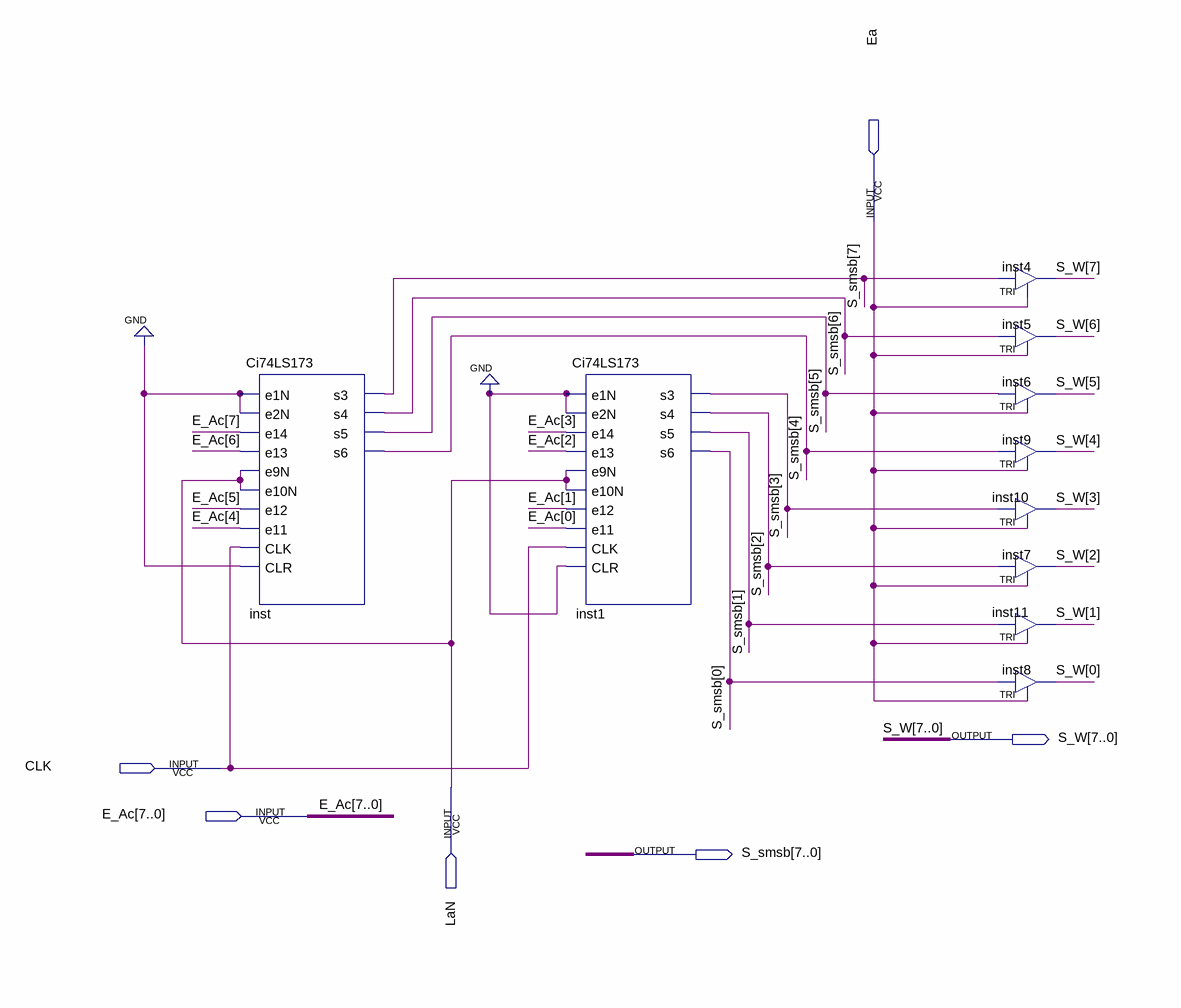
[diagram p0: schematic sheet]
// Quartus schematic Acumulador.bdf as structural Verilog: 10 symbols, 6 pins
module Acumulador (
  input  Ea,
  input  CLK,
  input  LaN,
  input  [7:0] E_Ac,
  output [7:0] S_W,
  output [7:0] S_smsb
);

  Ci74LS173 inst (
    .e1N(1'b0), .e2N(1'b0), .e14(E_Ac[7]), .e13(E_Ac[6]), .e9N(LaN), .e10N(LaN), .e12(E_Ac[5]),
    .e11(E_Ac[4]), .CLK(CLK), .CLR(1'b0), .s3(S_smsb[7]), .s4(S_smsb[6]), .s5(S_smsb[5]), .s6(S_smsb[4]));
  Ci74LS173 inst1 (
    .e1N(1'b0), .e2N(1'b0), .e14(E_Ac[3]), .e13(E_Ac[2]), .e9N(LaN), .e10N(LaN), .e12(E_Ac[1]),
    .e11(E_Ac[0]), .CLK(CLK), .CLR(1'b0), .s3(S_smsb[3]), .s4(S_smsb[2]), .s5(S_smsb[1]), .s6(S_smsb[0]));
  TRI inst4 (.IN(S_smsb[7]), .OE(Ea), .OUT(S_W[7]));
  TRI inst5 (.IN(S_smsb[6]), .OE(Ea), .OUT(S_W[6]));
  TRI inst6 (.IN(S_smsb[5]), .OE(Ea), .OUT(S_W[5]));
  TRI inst9 (.IN(S_smsb[4]), .OE(Ea), .OUT(S_W[4]));
  TRI inst10 (.IN(S_smsb[3]), .OE(Ea), .OUT(S_W[3]));
  TRI inst7 (.IN(S_smsb[2]), .OE(Ea), .OUT(S_W[2]));
  TRI inst11 (.IN(S_smsb[1]), .OE(Ea), .OUT(S_W[1]));
  TRI inst8 (.IN(S_smsb[0]), .OE(Ea), .OUT(S_W[0]));
endmodule
